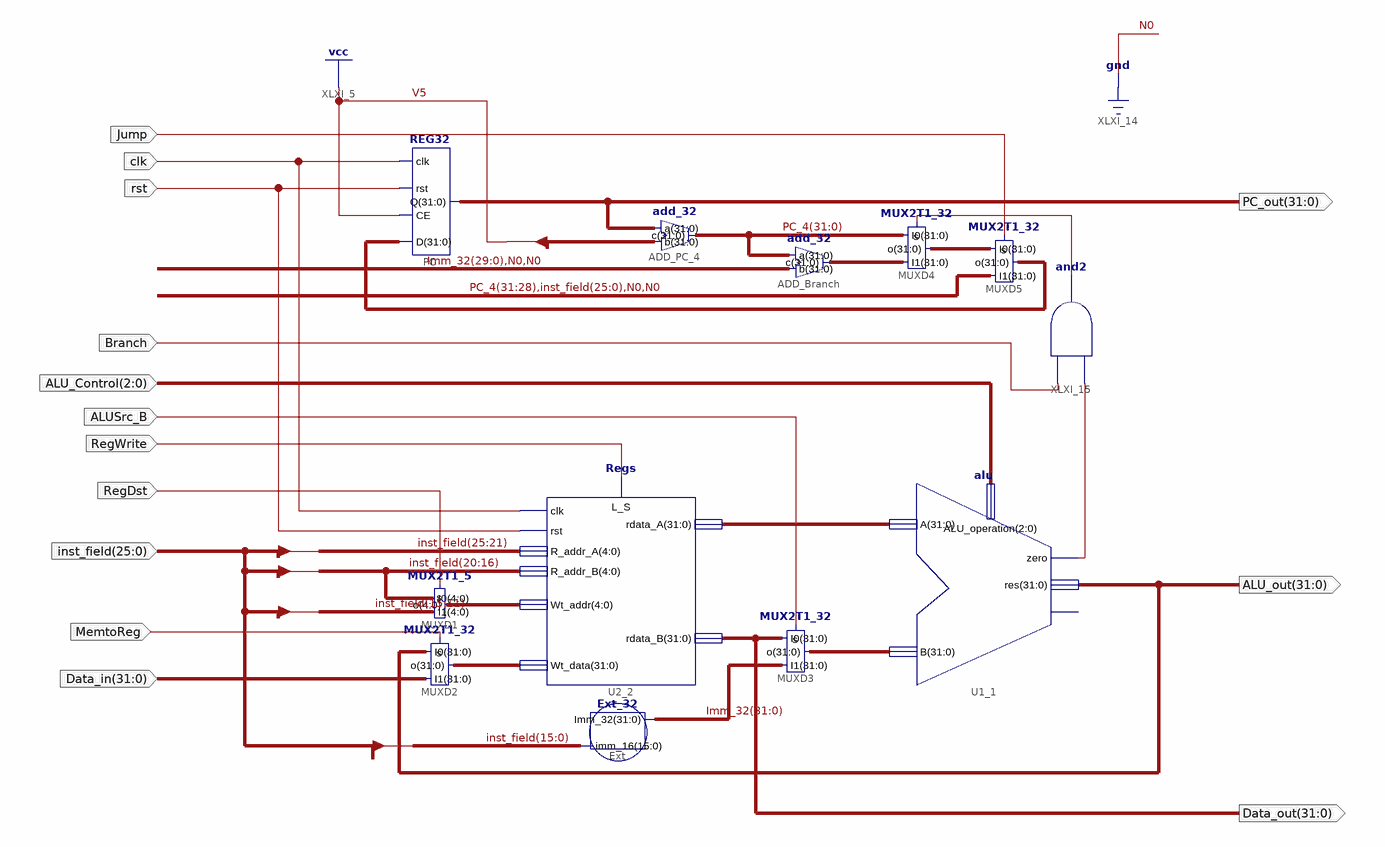
[diagram p0: schematic sheet 1]
// Xilinx ISE schematic Data_path.sch (kintex7) as structural Verilog: 12 symbols, 14 ports
module Data_path (
  input  clk,
  input  rst,
  input  RegDst,
  input  MemtoReg,
  input  [31:0] Data_in,
  input  [25:0] inst_field,
  input  RegWrite,
  input  ALUSrc_B,
  input  [2:0] ALU_Control,
  input  Jump,
  input  Branch,
  output [31:0] Data_out,
  output [31:0] ALU_out,
  output [31:0] PC_out
);

  wire XLXN_41, XLXN_42;
  wire [4:0] XLXN_10;
  wire [31:0] Imm_32, PC_4, XLXN_1, XLXN_3, XLXN_11, XLXN_33, XLXN_35, XLXN_40;

  REG32 PC (.D(XLXN_40), .CE(1'b1), .rst(rst), .clk(clk), .Q(PC_out));
  Regs U2_2 (
    .clk(clk), .L_S(RegWrite), .rdata_A(XLXN_1), .rst(rst), .Wt_data(XLXN_11), .rdata_B(Data_out),
    .R_addr_A(inst_field[25:21]), .R_addr_B(inst_field[20:16]), .Wt_addr(XLXN_10));
  alu U1_1 (.zero(XLXN_41), .res(ALU_out), .A(XLXN_1), .B(XLXN_3), .ALU_operation(ALU_Control));  // open: overflow
  MUX2T1_32 MUXD3 (.s(ALUSrc_B), .I0(Data_out), .I1(Imm_32), .o(XLXN_3));
  MUX2T1_32 MUXD2 (.s(MemtoReg), .I0(ALU_out), .I1(Data_in), .o(XLXN_11));
  MUX2T1_5 MUXD1 (.I1(inst_field[15:11]), .I0(inst_field[20:16]), .o(XLXN_10), .s(RegDst));
  Ext_32 Ext (.imm_16(inst_field[15:0]), .Imm_32(Imm_32));
  add_32 ADD_PC_4 (.c(PC_4), .a(PC_out), .b(32'b00000000000000000000000000000100));
  add_32 ADD_Branch (.c(XLXN_35), .a(PC_4), .b({Imm_32[29:0], 2'b00}));
  MUX2T1_32 MUXD4 (.s(XLXN_42), .I0(PC_4), .I1(XLXN_35), .o(XLXN_33));
  MUX2T1_32 MUXD5 (.s(Jump), .I0(XLXN_33), .I1({PC_4[31:28], inst_field, 2'b00}), .o(XLXN_40));
  and XLXI_15 (XLXN_42, XLXN_41, Branch);
endmodule
